# Altium schematic sheet 25D_KernelPeriod_test.SchDoc
size A4
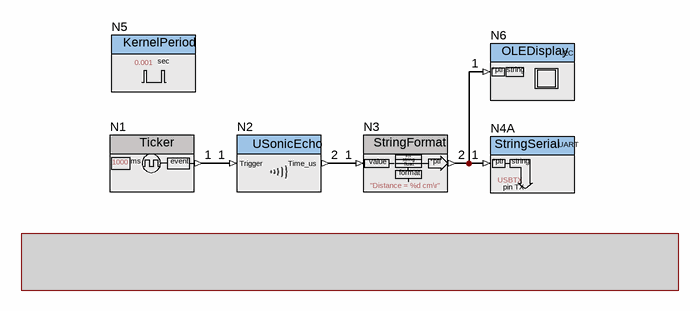
[diagram p0: 25D_KernelPeriod_test.SchDoc]

## Parts
N1  Ticker  nBlocksParameter1: 1000
N2  USonicEcho
N3  StringFormat  nBlocksParameter1: "Distance = %d cm\r"
N4  StringSerial  nBlocksParameter1: USBTX  (part A of 2)
N5  KernelPeriod  nBlocksParameter1: 0.001
N6  OLEDisplay

## Nets
NetN1_1: N1.1(OUT) N2.1(Trigger)
NetN2_2: N2.2(Time_us) N3.1(IN)
NetN3_2: N3.2(OUT) N4.1(TX) N6.1(value)

## Notes on the sheet
- (in symbol NODE-KernelPeriod) sec
- (in symbol NODE-OLEDisplay) I2C; *ptr; string
- (in symbol NODE-STRINGFORMAT) int; string; *ptr; value; float; format
- (in symbol NODE-STRINGSERIAL-split, part A) UART; *ptr; string; pin TX
- (in symbol NODE-TICKER) ms; event

## Library data of the parts
N1 = NODE-TICKER: Creates a Periodical Event; ComponentLink1Description: link; ComponentLink1URL: https://github.com/nBlocksStudioNodes/nblocks_ticker
N2 = NODE-USonicEcho: # USonicEcho / Ultrasonic distance sensor Node for the Parallax Ping / *  Category: Sensor / *  HAL: mbed / *  Tested: with LPC1768 / *  Author: N. Chalikias / ## Output data types / *  uint32_t: Echo time in micro-seconds for coefficient =1, or divided by the coefficient parameter / ## Inputs / Outputs / *  (Schematic pin 2) uint32_t: Echo time in micro-seconds / *  (Schematic pin 1) Trigger Input / ## Parameters: / *  PinName: EchoPin: Pin to be used for the signal from/to the board / *  uint32_t: coefficient: Value to divide the 2 ways echo time measured: / * 1 for raw 2 ways travel value in us / * 2 for one way travel in us / * 58 for one way in centimeters / * Any other value that suits a use case / ## Example: / [Ticker]-->[USonicEcho]-->[StringFormat]-->[StringSerial]; Parameter 1: pinEcho; nBlocksParameter1: p18; nBlocksParameter2: 58; ComponentLink1Description: link; ComponentLink1URL: https://github.com/nBlocksStudioNodes/nblocks_usonicecho; Parameter 2: coefficient
N3 = NODE-STRINGFORMAT: # StringFormat / Adds Formatting to a number in printf style / *  Category: String / *  HAL: mbed / *  Tested: LPC1768, STM32F103, STM32F401, nRF52832 / *  Author: Fernando Cosentino / ## Inputs/Outputs / *  (1) Input int: Value in form of string, or int or float / *  (2) Output uint32_t: Pointer to array of string, or int, or float / ## Parameters / *  formatString: example "Value: %d\n" / ## Example: / [Ticker][Counter][StringFormat][StringSerial] / Prints / “Value: 0” / “Value: 1” / “Value: 3” / … /; ComponentLink1Description: link; ComponentLink1URL: https://github.com/nBlocksStudioNodes/nblocks_stringformat; Parameter 1: formatString
N4 = NODE-STRINGSERIAL-split: StringSerial / This node implements a serial port, where characters received from the external world (RX pin) are sent one by one to the node's output, but the node's input expects a full string object as input (sent entirely within one frame to the TX pin). / DO NOT CONNECT integer data into this node, as it will definitely lead to incorrect behaviour, sending random bytes in unpredicted amount to the serial port. This can be harmful depending on your design.; nBlocksParameter2: USBRX; Parameter 2: pinRX; Parameter 1: pinTX; ComponentLink1Description: link; ComponentLink1URL: https://github.com/nBlocksStudioNodes/nblocks_stringserial
N5 = NODE-KernelPeriod: # KernelPeriod / Configures the nBlocksStudio Kernel `Tick` period / >  *  Category: Configuration / >  *  HAL: mbed / >  *  Tested: with LPC1768 / >  *  Author: F. Cosentino / ## Implementation Details / This is a configuration Node without any connectios / ## input/Output Connections ## / ``` / *  No connections / ``` / ## Node Parameters ## / ``` / *  float:  Period in sec / ``` / ## Usage Example ## / ``` / [KernelPeriod] / [Other]-->[Other] / ```; Parameter 1: period_sec; ComponentLink1Description: link; ComponentLink1URL: https://github.com/nBlocksStudioNodes/nblocks_KernelPeriod
N6 = NODE-OLEDisplay: # LM75 / This node handles temperature readings from a LM75 sensor over I2C. / *  Category: Sensor / *  HAL: mbed / *  Tested: LPC1768 / *  Author: Fernando Cosentino / ## Inputs/Outputs / *  (1) Trigger: Starts a measurement conversion / *  (2) Celcius:  °C  Temperature in degrees Celcius / ## Parameters / *  PinName: Pin connected to the sensor's SDA line / *  PinName: Pin connected to the sensor's SCL line / *  int: I2C address / *  float: alarmMin, Lower threshold for temperature alarm / *  float: alarmMax, Upper threshold for temperature alarm / *  int: comparatorPolarity, output value for the OS output when active / *  int: scale: Scale Factor / *  Multiplier for temperature value as integer (scale=100 means 2.5C will be represented as 250) / ## Example: / [Ticker]-->[LM75]-->[StringFormat]-->[StringSerial] /; Parameter 2: pinSCL; Parameter 1: pinSDA; Parameter 3: pinRST; nBlocksParameter3: p27; nBlocksParameter2: p10; nBlocksParameter1: p9; ComponentLink1Description: link; ComponentLink1URL: https://github.com/nBlocksStudioNodes/nblocks_oledisplay